# Altium schematic sheet mcu.SchDoc
size A
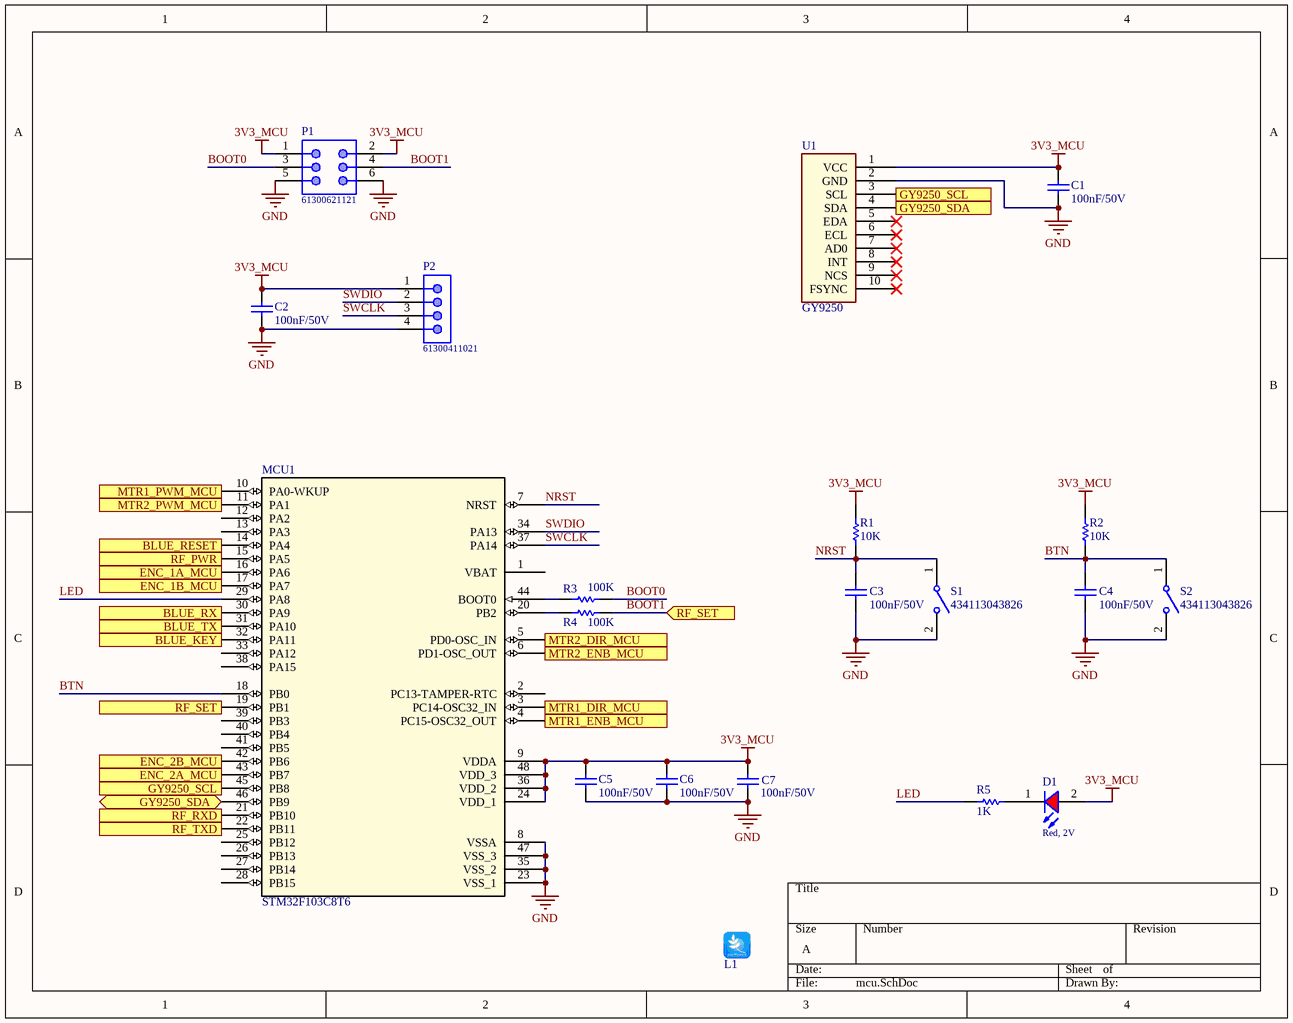
[diagram p0: mcu.SchDoc]

## Parts
C1  value 100nF/50V  [CAP-SM-0805]  (hidden comment: Cap-100nF-50V-0805)
C2  value 100nF/50V  [CAP-SM-0805]  (hidden comment: Cap-100nF-50V-0805)
C3  value 100nF/50V  [CAP-SM-0805]  (hidden comment: Cap-100nF-50V-0805)
C4  value 100nF/50V  [CAP-SM-0805]  (hidden comment: Cap-100nF-50V-0805)
C5  value 100nF/50V  [CAP-SM-0805]  (hidden comment: Cap-100nF-50V-0805)
C6  value 100nF/50V  [CAP-SM-0805]  (hidden comment: Cap-100nF-50V-0805)
C7  value 100nF/50V  [CAP-SM-0805]  (hidden comment: Cap-100nF-50V-0805)
D1  Red, 2V  [WL-SMCW_0805]
L1  LogoPIF  [PIF LOGO TOP OVERLAY]  (value not drawn)
MCU1  STM32F103C8T6  [STM32F103C8T6]
P1  61300621121  [61300621121]
P2  61300411021  [61300411021]
R1  value 10K  [RES-SM-0805]  (hidden comment: Res-10k-0805)
R2  value 10K  [RES-SM-0805]  (hidden comment: Res-10k-0805)
R3  value 100K  [RES-SM-0805]  (hidden comment: Res-100K-0805)
R4  value 100K  [RES-SM-0805]  (hidden comment: Res-100K-0805)
R5  value 1K  [RES-SM-0805]  (hidden comment: Res-1K-0805)
S1  434113043826  [434113043826]
S2  434113043826  [434113043826]
U1  GY9250  [GY9250]

## Ports
BLUE_KEY (out), BLUE_RESET (out), BLUE_RX (out), BLUE_TX (in), ENC_1A_MCU (in), ENC_1B_MCU (in), ENC_2A_MCU (in), ENC_2B_MCU (in), GY9250_SCL (in), GY9250_SCL (out), GY9250_SDA (bidir), GY9250_SDA (out), MTR1_DIR_MCU (out), MTR1_ENB_MCU (out), MTR1_PWM_MCU (out), MTR2_DIR_MCU (out), MTR2_ENB_MCU (out), MTR2_PWM_MCU (out), RF_PWR (out), RF_RXD (out), RF_SET (in), RF_SET (out), RF_TXD (in)

## Nets
3V3_MCU: C1.2 C2.2 C5.1 C6.1 C7.2 D1.2(A) MCU1.9(VDDA) MCU1.24(VDD_1) MCU1.36(VDD_2) MCU1.48(VDD_3) P1.1 P1.2 P2.1 R1.2 R2.2 U1.1(VCC)
GND: C1.1 C2.1 C3.1 C4.1 C5.2 C6.2 C7.1 MCU1.8(VSSA) MCU1.23(VSS_1) MCU1.35(VSS_2) MCU1.47(VSS_3) P1.5 P1.6 P2.4 S1.2 S2.2 U1.2(GND)
BLUE_KEY: MCU1.32(PA11) ; port BLUE_KEY
BLUE_RESET: MCU1.14(PA4) ; port BLUE_RESET
BLUE_RX: MCU1.30(PA9) ; port BLUE_RX
BLUE_TX: MCU1.31(PA10) ; port BLUE_TX
BOOT0: P1.3 R3.2
BOOT1: MCU1.19(PB1) P1.4 R4.2 ; port RF_SET
BTN: C4.2 MCU1.18(PB0) R2.1 S2.1
ENC_1A_MCU: MCU1.16(PA6) ; port ENC_1A_MCU
ENC_1B_MCU: MCU1.17(PA7) ; port ENC_1B_MCU
ENC_2A_MCU: MCU1.43(PB7) ; port ENC_2A_MCU
ENC_2B_MCU: MCU1.42(PB6) ; port ENC_2B_MCU
GY9250_SCL: MCU1.45(PB8) U1.3(SCL) ; port GY9250_SCL
GY9250_SDA: MCU1.46(PB9) U1.4(SDA) ; port GY9250_SDA
LED: MCU1.29(PA8) R5.1
MTR1_DIR_MCU: MCU1.3(PC14-OSC32_IN) ; port MTR1_DIR_MCU
MTR1_ENB_MCU: MCU1.4(PC15-OSC32_OUT) ; port MTR1_ENB_MCU
MTR1_PWM_MCU: MCU1.10(PA0-WKUP) ; port MTR1_PWM_MCU
MTR2_DIR_MCU: MCU1.5(PD0-OSC_IN) ; port MTR2_DIR_MCU
MTR2_ENB_MCU: MCU1.6(PD1-OSC_OUT) ; port MTR2_ENB_MCU
MTR2_PWM_MCU: MCU1.11(PA1) ; port MTR2_PWM_MCU
NRST: C3.2 MCU1.7(NRST) R1.1 S1.1
RF_PWR: MCU1.15(PA5) ; port RF_PWR
RF_RXD: MCU1.21(PB10) ; port RF_RXD
RF_TXD: MCU1.22(PB11) ; port RF_TXD
SWCLK: MCU1.37(PA14) P2.3
SWDIO: MCU1.34(PA13) P2.2
NetD1_1: D1.1(K) R5.2
NetMCU1_20: MCU1.20(PB2) R4.1
NetMCU1_44: MCU1.44(BOOT0) R3.1

Not connected (* = marked no-connect by the designer): MCU1 1(VBAT) 2(PC13-TAMPER-RTC) 12(PA2) 13(PA3) 25(PB12) 26(PB13) 27(PB14) 28(PB15) 33(PA12) 38(PA15) 39(PB3) 40(PB4) 41(PB5); U1 5(EDA)* 6(ECL)* 7(AD0)* 8(INT)* 9(NCS)* 10(FSYNC)*

## Library data of the parts
C1-C7 = Cap-100nF-50V-0805: CAP CER 0.1UF 50V Y5V 0805; Manufacturer: Samsung Electro-Mechanics; Manufacturer Part Number: CL21F104ZBCNNNC; Local Supplier: thegioiic; Local Supplier Link: https://thegioiic.com/products/tu-100nf-0-1uf-50v-0805; Supplier 1: Digikey; Supplier 1 Part Number: 1276-1007-1-ND; Supplier 1 Link: https://www.digikey.com/product-detail/en/samsung-electro-mechanics/CL21F104ZBCNNNC/1276-1007-1-ND/3889093
D1 = 150080RS75000: WL-SMCW SMT Mono-color Chip LED Waterclear, size 0805, Red, 2V, 140deg; Chip Technology: AlInGaP; Dominant Wavelength typ.: 625nm; Luminous Intensity typ.: 150mcd; Peak Wavelength typ.: 630nm; Viewing Angle: 140deg; ComponentLink1Description: Manufacturer; ComponentLink1URL: http://www.we-online.de; ComponentLink2URL: https://www.we-online.com/catalog/datasheet/150080RS75000.pdf; ComponentLink2Description: Datasheet; Forward Voltage typ.: 2V; Emitting Color: Red; Mounting Technology: SMT; Operating Temperature: -40 to +85degC; Published Date: December 2019; Part Number: 150080RS75000; Packaging: Tape and Reel; Size: 0805; Publisher: Wurth Elektronik
MCU1 = STM32F103C8T6: Vendor: STMicroelectronics; Built_By: EMA_UL_Team; Manufacturer_Part_Number: STM32F103C8T6; Copyright: Copyright (C) 2018 Accelerated Designs. All rights reserved; RefDes: RefDes; Type: DEV
P1 = 61300621121: WR-PHD Pin Header, THT, pitch 2.54mm, Dual Row, Vertical, 6p; Manufacturer: Wurth Elektronik; Pin Number: 6; Rated Current: 3A; Working Voltage: 250VAC; Withstanding Voltage: 500VAC; Contact Resistance: 20mOhm; ComponentLink1Description: Manufacturer; ComponentLink1URL: http://www.we-online.de; ComponentLink2Description: Datasheet; ComponentLink2URL: https://www.we-online.com/catalog/datasheet/61300621121.pdf; Manufacturer Part Number: 61300621121; Published Date: May 2020; Pitch: 2.54mm; Operating Temperature: -40 to +105degC; Mounting Technology: THT; Packaging: Bag; Gender: Pin Header; Row Number: Dual; Orientation: Vertical
P2 = 61300411021: WR-PHD Pin Header, THT, pitch 2.54mm, Single Row, Angled, 4p; Manufacturer: Wurth Elektronik; Pin Number: 4; Rated Current: 3A; Working Voltage: 250VAC; Withstanding Voltage: 500VAC; Contact Resistance: 20mOhm; ComponentLink1Description: Manufacturer; ComponentLink1URL: http://www.we-online.de; ComponentLink2Description: Datasheet; ComponentLink2URL: https://www.we-online.com/catalog/datasheet/61300411021.pdf; Manufacturer Part Number: 61300411021; Published Date: May 2020; Pitch: 2.54mm; Operating Temperature: -40 to +105degC; Mounting Technology: THT; Packaging: Bag; Gender: Pin Header; Row Number: Single; Orientation: Angled
R1 R2 = Res-10k-0805: RES 10K OHM 1% 1/4W 0805; Manufacturer: Stackpole Electronics Inc; Manufacturer Part Number: RNCP0805FTD10K0; Local Supplier: thegioiic; Local Supplier Link: https://thegioiic.com/products/dien-tro-10k-ohm-0805-5; Supplier 1: Digikey; Supplier 1 Link: https://www.digikey.com/product-detail/en/stackpole-electronics-inc/RNCP0805FTD10K0/RNCP0805FTD10K0CT-ND/2240601; Supplier 1 Part Number: RNCP0805FTD10K0CT-ND
R3 R4 = Res-100K-0805: RES 0 OHM JUMPER 0805; Manufacturer: Vishay Dale; Manufacturer Part Number: WSL080500000ZEA9; Local Supplier: thegioiic; Local Supplier Link: https://thegioiic.com/products/dien-tro-0-ohm-0805-5; Supplier 1: Digikey; Supplier 1 Link: https://www.digikey.com/product-detail/en/vishay-dale/WSL080500000ZEA9/541-3928-1-ND/7423223; Supplier 1 Part Number: 541-3928-1-ND
R5 = Res-1K-0805: RES 1K OHM 1% 1/4W 0805; Manufacturer: Stackpole Electronics Inc; Manufacturer Part Number: RNCP0805FTD1K00; Local Supplier: thegioiic; Local Supplier Link: https://thegioiic.com/products/dien-tro-1k-ohm-0805-5; Supplier 1: Digikey; Supplier 1 Link: https://www.digikey.com/product-detail/en/stackpole-electronics-inc/RNCP0805FTD1K00/RNCP0805FTD1K00CT-ND/2240568; Supplier 1 Part Number: RNCP0805FTD1K00CT-ND
S1 S2 = 434113043826: WS-TASV J-Bend SMT Tact Switch 6x3.5mm, height 4.3mm, 260gf; Rated Voltage: 12VDC; Rated Current: 50mA; Washable: No; ComponentLink1Description: Manufacturer; ComponentLink1URL: http://www.we-online.de; ComponentLink2Description: Datasheet; ComponentLink2URL: https://katalog.we-online.com/em/datasheet/434113043826.pdf; Operating Temperature: -40 to +85degC; Part Number: 434113043826; Published Date: September 2019; Contact Material: Stainless Steel; Height: 4.3mm; Mounting Technology: SMT; Contact Plating: Silver; Operation Force: 260gf; Packaging: Tape and Reel; Terminal Material: Copper Alloy; Publisher: Wurth Elektronik; Terminal Plating: Silver
L1 = LogoPIF: Local Supplier: x; Local Supplier Link: x
U1 = GY9250: Local Supplier Part Number: *; Local Supplier Link: *; Local Supplier: HShop; Manufacturer: *; Manufacturer Part Number: *